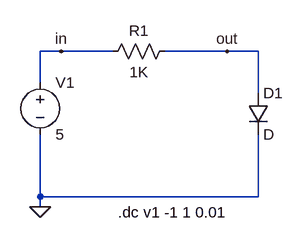
[diagram p0: schematic DCsweep.asc]
DCsweep.asc, the LTspice schematic file:
Version 4.1
SHEET 1 880 680
WIRE 80 80 48 80
WIRE 160 80 80 80
WIRE 336 80 240 80
WIRE 384 80 336 80
WIRE 48 128 48 80
WIRE 384 144 384 80
WIRE 48 304 48 208
WIRE 384 304 384 208
WIRE 384 304 48 304
WIRE 48 320 48 304
FLAG 80 80 in
FLAG 336 80 out
FLAG 48 320 0
SYMBOL voltage 48 112 R0
SYMATTR InstName V1
SYMATTR Value 5
SYMBOL res 256 64 R90
WINDOW 0 0 56 VBottom 2
WINDOW 3 32 56 VTop 2
SYMATTR InstName R1
SYMATTR Value 1K
SYMBOL diode 368 144 R0
SYMATTR InstName D1
TEXT 168 328 Left 2 !.dc v1 -1 1 0.01

The netlist it stands for:
* DCsweep.asc
V1 in 0 5
R1 out in 1K
D1 out 0 D
.model D D
.lib standard.dio
.dc v1 -1 1 0.01
.backanno
.end